# EAGLE design voltage_dividers (EAGLE 9.6.2)
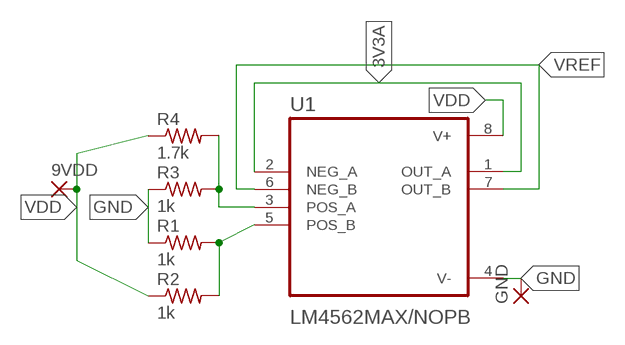
[diagram p0: schematic, sheet 1]

## Parts
9VDD  SMD2  [SMD1,27-2,54]
GND  SMD2  [SMD1,27-2,54]
R1  1k  R-US_R0402  [R0402]
R2  1k  R-US_R0402  [R0402]
R3  1k  R-US_R0402  [R0402]
R4  1.7k  R-US_R0402  [R0402]
U1  LM4562MAX/NOPB  [SOIC127P599X175-8N]

## Nets
3V3A: U1.1(OUT_A) U1.2(NEG_A)
GND: GND.1(P) R1.1 R3.1 U1.4(V-)
N$1: R3.2 R4.2 U1.3(POS_A)
N$2: R1.2 R2.2 U1.5(POS_B)
VDD: 9VDD.1(P) R2.1 R4.1 U1.8(V+)
VREF: U1.6(NEG_B) U1.7(OUT_B)

## Library data of the parts
9VDD GND = wirepad:SMD2: SMD PAD
R1-R4 = rcl:R-US_: RESISTOR, American symbol; SPICEPREFIX: R
U1 = LM4562MAX_NOPB:LM4562MAX/NOPB: Check availability <https://pricing.snapeda.com/parts/LM4562MAX/NOPB/Texas%20Instruments/view-part?ref=eda>; AVAILABILITY: In Stock; CHECK_PRICES: https://www.snapeda.com/parts/LM4562MAX/NOPB/Texas+Instruments/view-part/?ref=eda; DESCRIPTION: 2-channel, 55-MHz, high-fidelity, high performance audio op amp; MF: Texas Instruments; MP: LM4562MAX/NOPB; PACKAGE: SOIC-8 Texas Instruments; PRICE: None; PURCHASE-URL: https://www.snapeda.com/api/url_track_click_mouser/?unipart_id=21165&manufacturer=Texas Instruments&part_name=LM4562MAX/NOPB&search_term=lm4562; SNAPEDA_LINK: https://www.snapeda.com/parts/LM4562MAX/NOPB/Texas+Instruments/view-part/?ref=snap

## Board
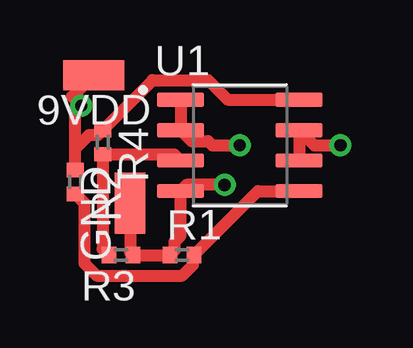
[diagram p1: board, top side]

No outline drawn. Coordinates in mm, seen from the top.
Copper layers (1+2*15+16): Top 0.035mm / dielectric 0.2mm / Route2 0.035mm / dielectric 0.15mm / Route15 0.035mm / dielectric 0.2mm / Bottom 0.035mm
Design rules "default *": minimum track width 6mil, minimum drill 0.35mm, track to track 6mil, track to pad 6mil, pad to pad 6mil, via to via 6mil, smd to smd 6mil, copper to edge 40mil, drill to drill 6mil, minimum pad ring 10mil, minimum via ring 8mil, stop-mask expansion 4mil, vias tented up to drill 0mil, thermal gap 10mil

### Footprints (pad centres in the part's own frame; a part is rotated, then mirrored left to right if it is on the bottom)
SMD1,27-2,54 = smd 1.27 x 2.54: 1 0,0
R0402 = smd 0.6 x 0.7: 1 -0.5,0; 2 0.5,0
SOIC127P599X175-8N = smd 1.97 x 0.6: 1 -2.47,1.905; 2 -2.47,0.635; 3 -2.47,-0.635; 4 -2.47,-1.905; 5 2.47,-1.905; 6 2.47,-0.635; 7 2.47,0.635; 8 2.47,1.905

### Placement (x,y rotation side)
9VDD  6.6,10.54 90 top
GND  8.13,5.21 0 top
R1  10.29,3.05 0 top
R2  5.84,6.1 270 top
R3  7.75,3.05 180 top
R4  6.99,7.75 270 top
U1  12.7,7.62 0 top

### Tracks (layer width: path | path; a pad name or v marks a point on that pad's centre or on a via)
3V3A  (via drill 0.51)
  Top 0.508: U1.1 U1.2 10.69,7.79 11.38,7.79 11.55,7.62 v12.7,7.62
GND  (via drill 0.51)
  Top 0.508: v12.06,5.97 10.48,5.97 U1.4 10.23,3.86 9.98,3.61 9.98,3.24 R1.1 R3.1 8.13,3.17 GND.1
N$1
  Top 0.508: R3.2 6.99,3.31 R4.2 9.97,7.25 U1.3
N$2
  Top 0.508: U1.5 13.45,5.71 R1.2 10.74,3 10.74,2.63 10.3,2.19 6.74,2.19 6.22,2.7 6.22,5.21 R2.2
VDD  (via drill 0.51)
  Top 0.508: U1.8 12.19,9.53 11.38,10.33 9.07,10.33 R4.1 6.79,8.05 6.42,8.05 5.84,7.47 R2.1 5.84,9.02 v6.1,9.27 5.71,9.65 9VDD.1
VREF  (via drill 0.51)
  Top 0.508: U1.6 U1.7 15.8,7.62 v16.89,7.62